# Altium schematic sheet Sheet1 - Copy.SchDoc
size A0
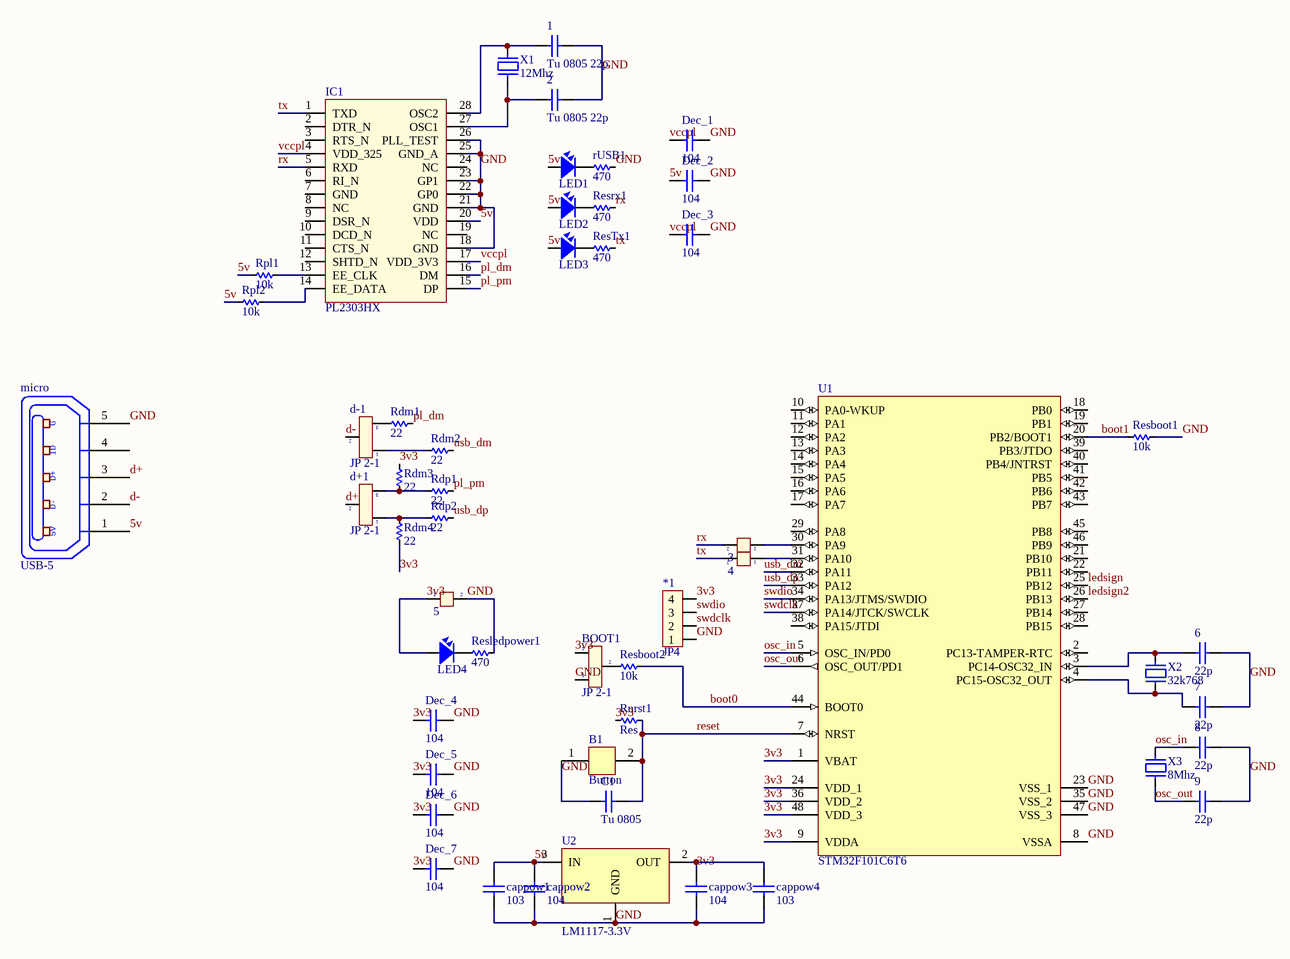
[diagram p0: Sheet1 - Copy.SchDoc]

## Parts
1  Tu 0805 22p  [Tu 0805]
2  Tu 0805 22p  [Tu 0805]
3  Jumper 2  [JP2]  (value not drawn)
4  Jumper 2  [JP2]  (value not drawn)
5  Jumper 2  [JP2]  (value not drawn)
6  22p  [Tu 0805]
7  22p  [Tu 0805]
8  22p  [Tu 0805]
9  22p  [Tu 0805]
*1  JP4  [JP4]
B1  Button  [Button 2 Pin]
BOOT1  JP 2-1  [JP3]
C1  Tu 0805  [Tu 0805]
cappow1  103  [Tu 0805]
cappow2  104  [Tu 0805]
cappow3  104  [Tu 0805]
cappow4  103  [Tu 0805]
d+1  JP 2-1  [JP3]
d-1  JP 2-1  [JP3]
Dec_1  104  [Tu 0805]
Dec_2  104  [Tu 0805]
Dec_3  104  [Tu 0805]
Dec_4  104  [Tu 0805]
Dec_5  104  [Tu 0805]
Dec_6  104  [Tu 0805]
Dec_7  104  [Tu 0805]
IC1  PL2303HX  [SO-G28/C6.8]
LED1  LED SMD  [SM-LED-1206-Red]  (value not drawn)
LED2  LED SMD  [SM-LED-1206-Red]  (value not drawn)
LED3  LED SMD  [SM-LED-1206-Red]  (value not drawn)
LED4  LED SMD  [SM-LED-1206-Red]  (value not drawn)
micro  USB-5  [USB-M1]
Rdm1  22  [RES-SMD-0805]
Rdm2  22  [RES-SMD-0805]
Rdm3  22  [RES-SMD-0805]
Rdm4  22  [RES-SMD-0805]
Rdp1  22  [RES-SMD-0805]
Rdp2  22  [RES-SMD-0805]
Resboot1  10k  [RES-SMD-0805]
Resboot2  10k  [RES-SMD-0805]
Resledpower1  470  [RES-SMD-0805]
Resrx1  470  [RES-SMD-0805]
ResTx1  470  [RES-SMD-0805]
Rnrst1  Res  [RES-SMD-0805]
Rpl1  10k  [RES-SMD-0805]
Rpl2  10k  [RES-SMD-0805]
rUSB1  470  [RES-SMD-0805]
U1  STM32F101C6T6  [TQFP48]
U2  LM1117-3.3V  [LM1117-SOP]
X1  12Mhz  [XT2-SMD]
X2  32k768  [XT32k]
X3  8Mhz  [XT2-SMD]

## Nets
3v3: 5.1 *1.4 BOOT1.1 cappow3.2 cappow4.2 Dec_4.1 Dec_5.1 Dec_6.1 Dec_7.1 LED4.1 Rdm3.1 Rdm4.2 Rnrst1.2 U1.1(VBAT) U1.9(VDDA) U1.24(VDD_1) U1.36(VDD_2) U1.48(VDD_3) U2.2(OUT)
5v: cappow1.2 cappow2.2 Dec_2.1 IC1.20(VDD) LED1.1 LED2.1 LED3.1 micro.1(P1) Rpl1.2 Rpl2.2 U2.3(IN)
boot0: Resboot2.1 U1.44(BOOT0)
boot1: Resboot1.2 U1.20(PB2/BOOT1)
d+: d+1.2 micro.3(P3)
d-: d-1.2 micro.2(P2)
GND: 1.2 2.2 5.2 6.2 7.2 8.2 9.2 *1.1 B1.1 BOOT1.3 C1.2 cappow1.1 cappow2.1 cappow3.1 cappow4.1 Dec_1.1 Dec_2.2 Dec_3.2 Dec_4.2 Dec_5.2 Dec_6.2 Dec_7.2 IC1.18(GND) IC1.21(GND) IC1.22(GP0) IC1.23(GP1) IC1.25(GND_A) IC1.26(PLL_TEST) micro.5(P5) Resboot1.1 Resledpower1.1 rUSB1.1 U1.8(VSSA) U1.23(VSS_1) U1.35(VSS_2) U1.47(VSS_3) U2.1(GND)
ledsign: U1.25(PB12)
ledsign2: U1.26(PB13)
osc_in: 8.1 U1.5(OSC_IN/PD0) X3.2
osc_out: 9.1 U1.6(OSC_OUT/PD1) X3.1
pl_dm: IC1.16(DM) Rdm1.1
pl_pm: IC1.15(DP) Rdp1.1
reset: B1.2 C1.1 Rnrst1.1 U1.7(NRST)
rx: 3.2 IC1.5(RXD) Resrx1.1
swdclk: *1.2 U1.37(PA14/JTCK/SWCLK)
swdio: *1.3 U1.34(PA13/JTMS/SWDIO)
tx: 4.2 IC1.1(TXD) ResTx1.1
usb_dm: Rdm2.1 U1.32(PA11)
usb_dp: Rdp2.1 U1.33(PA12)
vccpl: Dec_1.2 Dec_3.1 IC1.4(VDD_325) IC1.17(VDD_3V3)
Net1_1: 1.1 IC1.28(OSC2) X1.2
Net2_1: 2.1 IC1.27(OSC1) X1.1
Net3_1: 3.1 U1.30(PA9)
Net4_1: 4.1 U1.31(PA10)
Net6_1: 6.1 U1.3(PC14-OSC32_IN) X2.2
Net7_1: 7.1 U1.4(PC15-OSC32_OUT) X2.1
NetBOOT1_2: BOOT1.2 Resboot2.2
Netd+1_1: d+1.1 Rdm4.1 Rdp2.2
Netd+1_3: d+1.3 Rdm3.2 Rdp1.2
Netd-1_1: d-1.1 Rdm2.2
Netd-1_3: d-1.3 Rdm1.2
NetIC1_13: IC1.13(EE_CLK) Rpl1.1
NetIC1_14: IC1.14(EE_DATA) Rpl2.1
NetLED1_2: LED1.2 rUSB1.2
NetLED2_2: LED2.2 Resrx1.2
NetLED3_2: LED3.2 ResTx1.2
NetLED4_2: LED4.2 Resledpower1.2

Not connected (* = marked no-connect by the designer): IC1 2(DTR_N) 3(RTS_N) 6(RI_N) 7(GND) 8(NC) 9(DSR_N) 10(DCD_N) 11(CTS_N) 12(SHTD_N) 19(NC) 24(NC); micro 4(P4); U1 2(PC13-TAMPER-RTC) 10(PA0-WKUP) 11(PA1) 12(PA2) 13(PA3) 14(PA4) 15(PA5) 16(PA6) 17(PA7) 18(PB0) 19(PB1) 21(PB10) 22(PB11) 27(PB14) 28(PB15) 29(PA8) 38(PA15/JTDI) 39(PB3/JTDO) 40(PB4/JNTRST) 41(PB5) 42(PB6) 43(PB7) 45(PB8) 46(PB9)

## Notes on the sheet
- (in symbol USB-5) G; ID; D+; D-; 5V

## Library data of the parts
1 2 6-9 C1 cappow1-cappow4 Dec_1-Dec_7 = CAP 0805
3-5 = JP 2: Value: JP 2
B1 = Button 2 Pin
BOOT1 d+1 d-1 = JP 2-1_1: Jumper 2-1; Value: J2-1
IC1 = PL2303HX: USB - RS232 Converter; Value: PL2303
LED1-LED4 = LED-SMD-1206
micro = USB-5: Manufacturer: FCI; Manufacturer Part Number: 10118193-0001LF; Connector Type: USB - micro B; Number of Contacts: 5; Gender: Receptacle; Specifications: USB 2.0; .Creator: MM; .Checked PCB: RF; Supplier 1: Digi-Key; RoHS: RoHS Compliant; Category: Connectors, Interconnects; Stock 1: 28642; Pricing 1: 1=0.46, 10=0.433, 25=0.3712, 50=0.3156, 100=0.3032, 250=0.27224, 500=0.25988 (USD); Packaging: Cut Tape (CT); Mounting Type: Surface Mount, Right Angle, Horizontal; Features: Shielded, Solder Retention; Ingress Protection: -; ComponentLink1URL: http://portal.fciconnect.com/Comergent//fci/drawing/10118193.pdf; ComponentLink1Description: http://portal.fciconnect.com/Comergent//fci/drawing/10118193.pdf; Supplier Part Number 1: 609-4616-1-ND; .Checked SCH: MM
Rdm1-Rdm4 Rdp1 Rdp2 Resboot1 Resboot2 Resledpower1 Resrx1 ResTx1 Rnrst1 Rpl1 Rpl2 rUSB1 = Res-SMD: Resistor; Manufacturer: Generic Components; Class: Passive; Published: 08/06/2000; Publisher: Altium Hobart Technology Centre
U1 = STM32F101C6T6: STM32 ARM-based 32-bit MCU with 32 Kbytes Flash, 48-pin LQFP, Industrial Temperature; Published: 30-May-2008; DatasheetVersion: rev6, Mar-2008; PackageVersion: Mar-2008; PackageReference: LQFP48; Publisher: Altium Limited; PackageDescription: 48-Pin Low-Profile Quad Flat Pack, 7 x 7 mm Body, 0.5 mm Pitch (LQFP48); ComponentLink1Description: Manufacturer Link; ComponentLink1URL: www.st.com/stm32; ComponentLink2Description: Datasheet; ComponentLink2URL: http://www.st.com/stonline/products/literature/ds/13586.pdf
U2 = LM1117: 800mA Low-Dropout Linear Regulator; Creator: Nguyen Ba Bien; Website: http://group3i.net
X1-X3 = XT2: Crystal, 32.768 KHz, -40 to 85 degC, 3.2 x 1.5 x 0.9 mm SMD; Value: 4Mhz